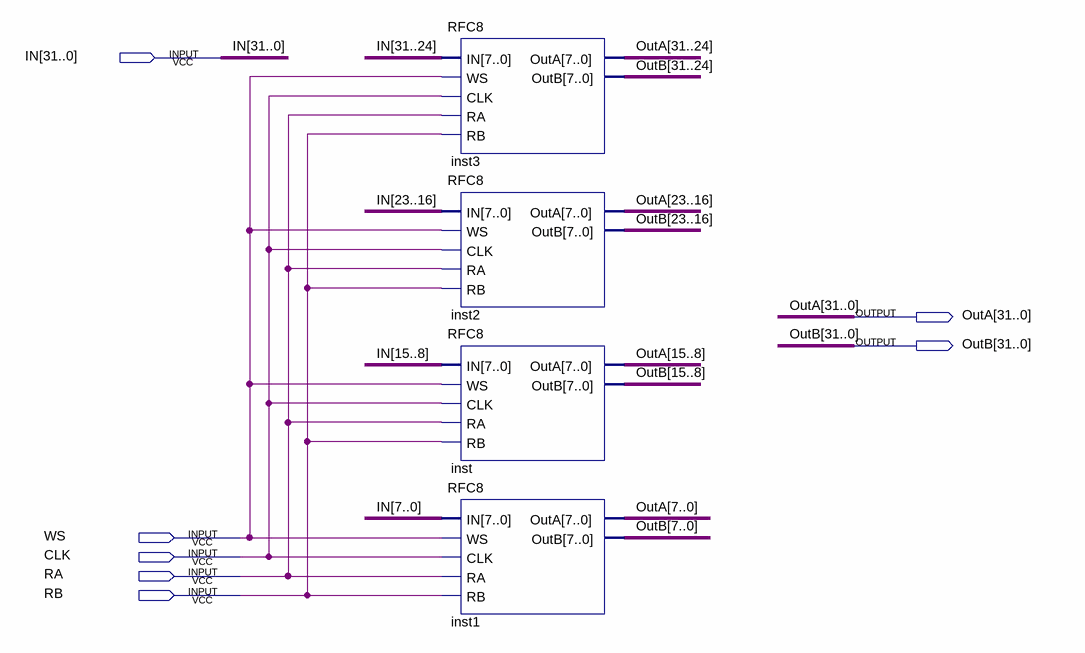
[diagram p0: schematic sheet]
// Quartus schematic RFC32.bdf as structural Verilog: 4 symbols, 7 pins
module RFC32 (
  input  [31:0] IN,
  input  WS,
  input  CLK,
  input  RA,
  input  RB,
  output [31:0] OutA,
  output [31:0] OutB
);

  RFC8 inst3 (.IN(IN[31:24]), .WS(WS), .CLK(CLK), .RA(RA), .RB(RB), .OutA(OutA[31:24]), .OutB(OutB[31:24]));
  RFC8 inst2 (.IN(IN[23:16]), .WS(WS), .CLK(CLK), .RA(RA), .RB(RB), .OutA(OutA[23:16]), .OutB(OutB[23:16]));
  RFC8 inst (.IN(IN[15:8]), .WS(WS), .CLK(CLK), .RA(RA), .RB(RB), .OutA(OutA[15:8]), .OutB(OutB[15:8]));
  RFC8 inst1 (.IN(IN[7:0]), .WS(WS), .CLK(CLK), .RA(RA), .RB(RB), .OutA(OutA[7:0]), .OutB(OutB[7:0]));
endmodule
